# Altium schematic sheet AMC_SATA_Adapter.SchDoc: AMC to SATA
size 420 x 297 mm; Author: G.K.; CompanyName: WUT; DrawnBy: G.K.; Organization: CERN; Address1: Warsaw Univeristy of Technology; Address2: Nowowiejska 15/19; Revision: -; SheetNumber: -; SheetTotal: -; EDA_Number: ARTIQ; Projet: SINARA; ModifiedBy: -; CreateDate: XX/XX/XXXX; CheckedDate: -; Title2: Adapter; DivGrp: ISE; Designer: G.K.; ModifiedDate: -; ProjectName: SINARA
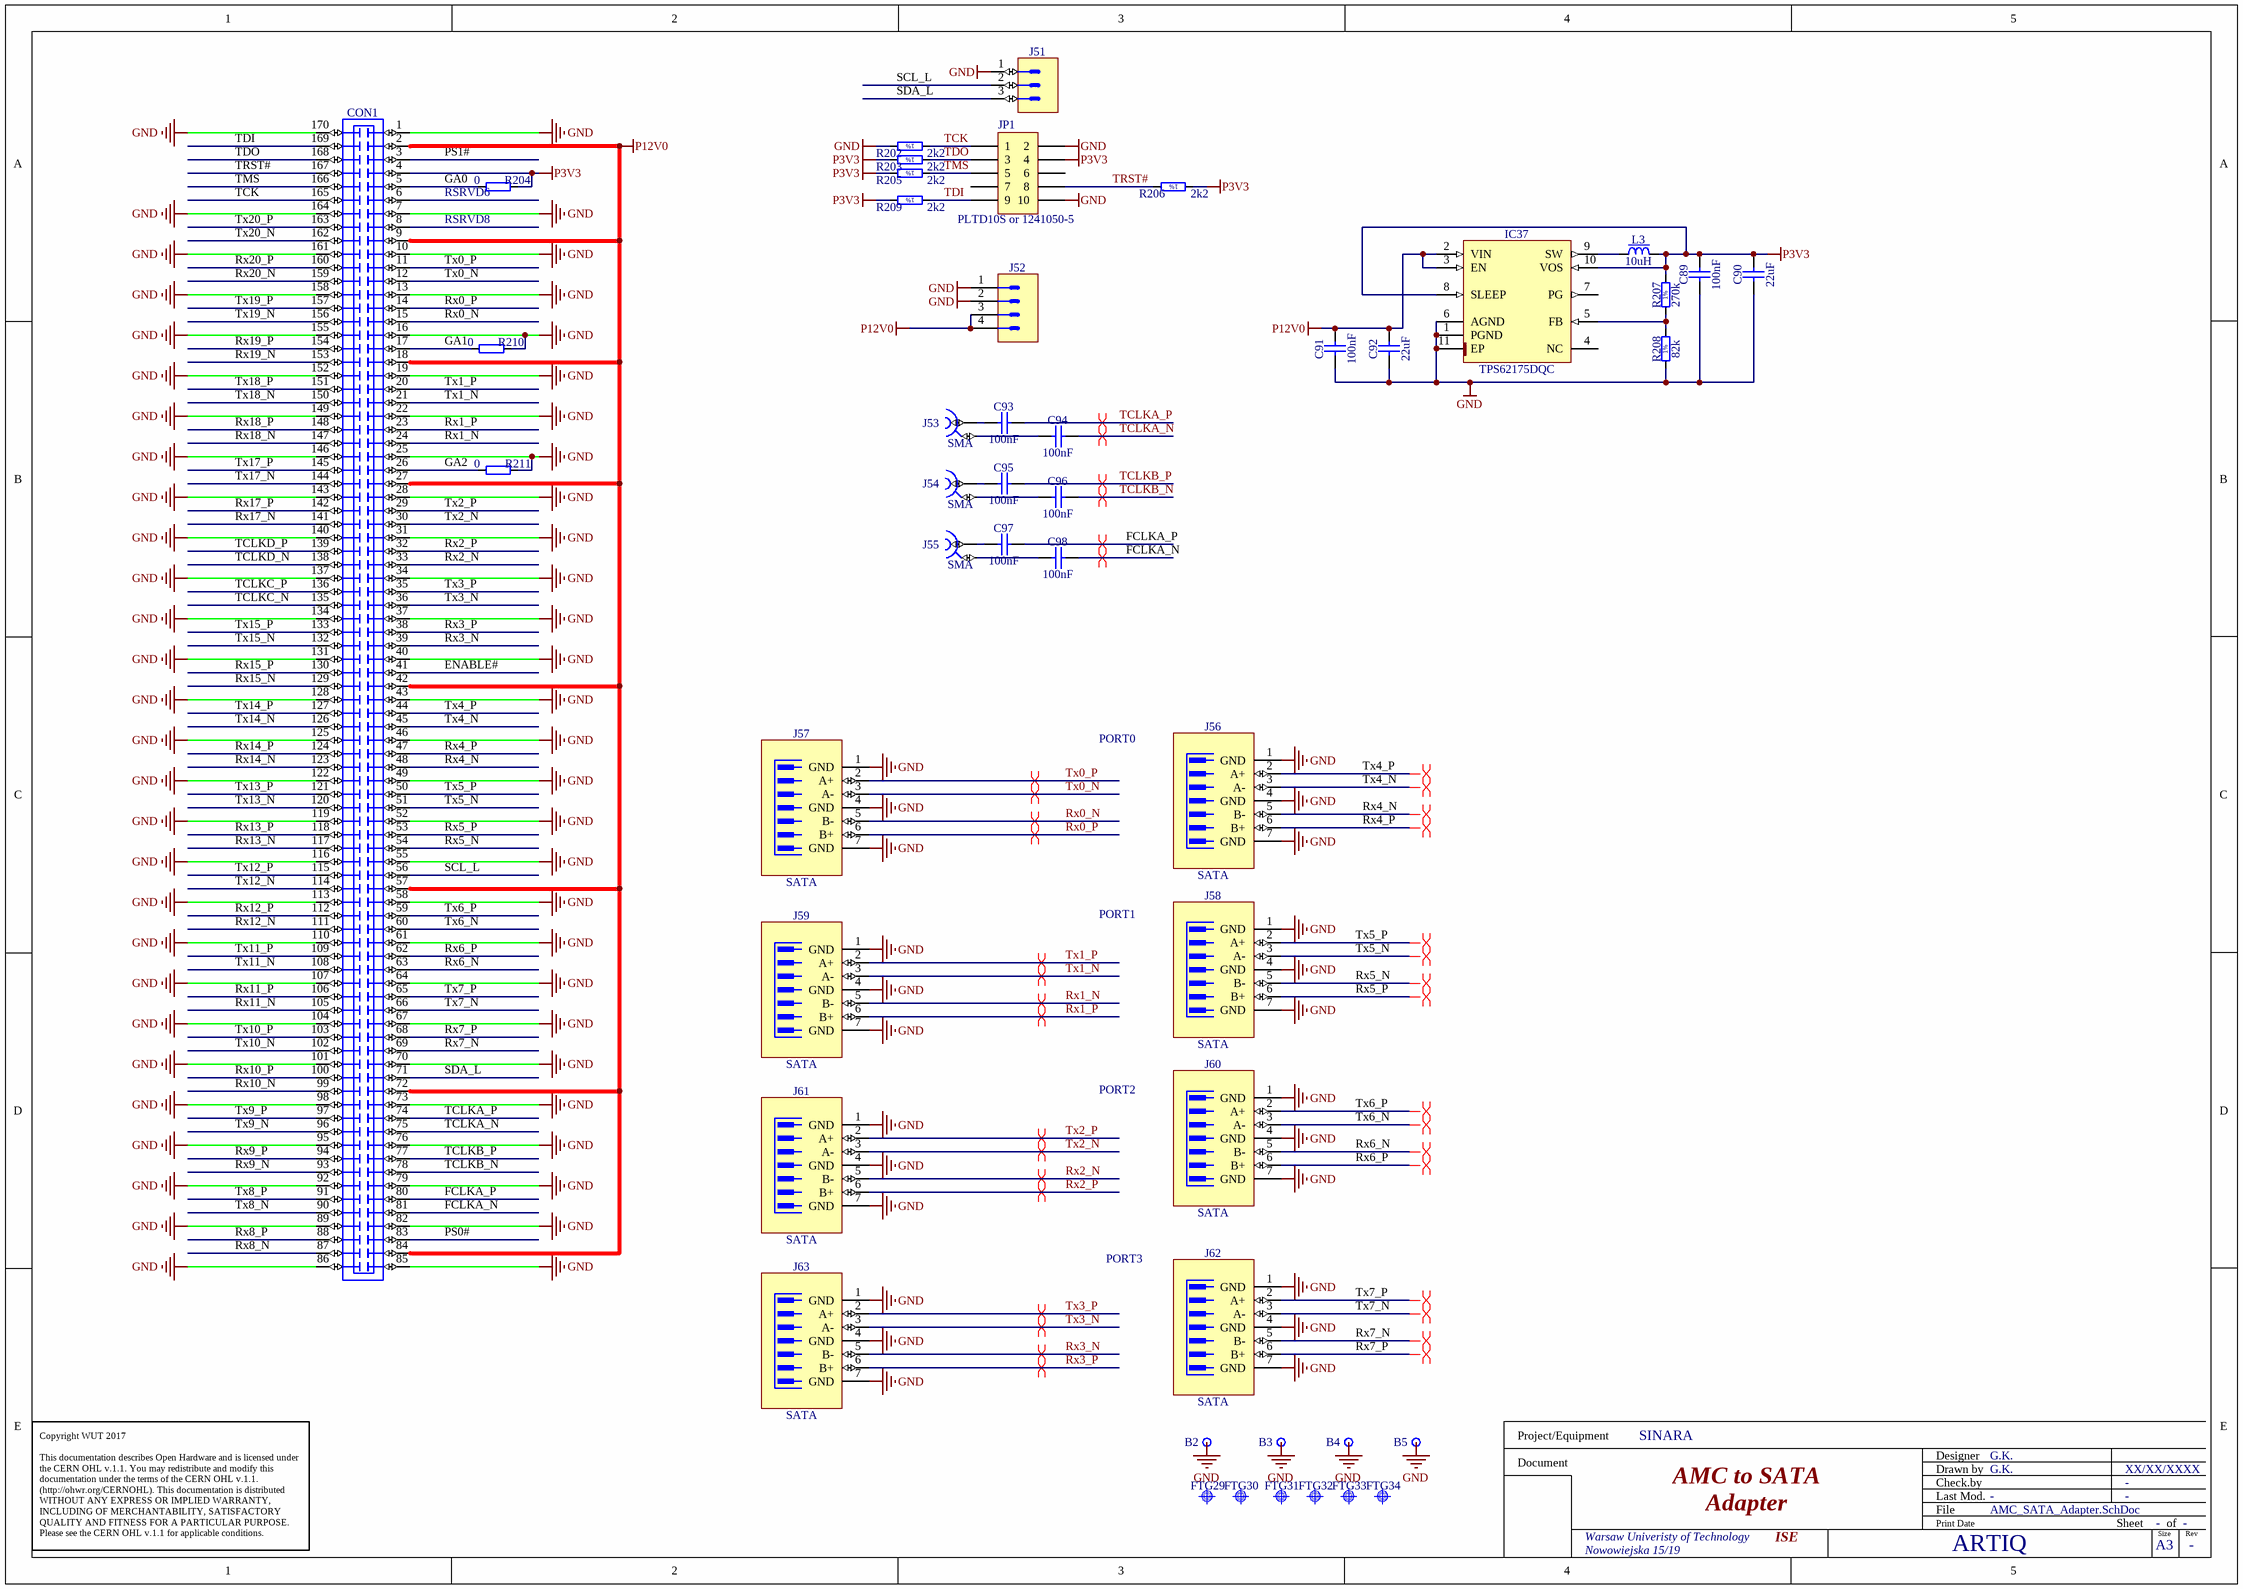
[diagram p0: AMC_SATA_Adapter.SchDoc]

## Parts
B2  (no value)  [MTG270_500]
B3  (no value)  [MTG270_500]
B4  (no value)  [MTG270_500]
B5  (no value)  [MTG270_500]
C89  100nF  [CAPC1005X55N]
C90  22uF  [CAPC2012X135N]
C91  100nF  [CAPC1005X55N]
C92  22uF  [CAPC2012X135N]
C93  100nF  [CAPC0603X33N]
C94  100nF  [CAPC0603X33N]
C95  100nF  [CAPC0603X33N]
C96  100nF  [CAPC0603X33N]
C97  100nF  [CAPC0603X33N]
C98  100nF  [CAPC0603X33N]
CON1  SAMTEC_MTCA-085-02-S-DV-SMT-K-TR  [SAMTEC_MTCA-085-02-S-DV-SMT-K-TR]  (value not drawn)
FTG29  Use only in PCB  (value not drawn)
FTG30  Use only in PCB  (value not drawn)
FTG31  Use only in PCB  (value not drawn)
FTG32  Use only in PCB  (value not drawn)
FTG33  Use only in PCB  (value not drawn)
FTG34  Use only in PCB  (value not drawn)
IC37  TPS62175DQC  [SON50P200X300X80-11N-R94X250]
J51  Header 3  [HARWIN_M22-2010305]  (value not drawn)
J52  Mini-Fit Jr.™  [MOLEX_39-28-1043]  (value not drawn)
J53  SMA  [HUBER-SUHNER_82_SMA-50-0-41/133_NE]
J54  SMA  [HUBER-SUHNER_82_SMA-50-0-41/133_NE]
J55  SMA  [HUBER-SUHNER_82_SMA-50-0-41/133_NE]
J56  SATA  [MOLEX_67800-5005]
J57  SATA  [MOLEX_67800-5005]
J58  SATA  [MOLEX_67800-5005]
J59  SATA  [MOLEX_67800-5005]
J60  SATA  [MOLEX_67800-5005]
J61  SATA  [MOLEX_67800-5005]
J62  SATA  [MOLEX_67800-5005]
J63  SATA  [MOLEX_67800-5005]
JP1  PLTD10S or 1241050-5  [PLTD10S]
L3  10uH  [IND_MURATA-PS_8400]
R202  2k2  [RESC1005X40N]
R203  2k2  [RESC1005X40N]
R204  0  [RESC1005X40N]
R205  2k2  [RESC1005X40N]
R206  2k2  [RESC1005X40N]
R207  270k  [RESC1608X55N]
R208  82k  [RESC1608X55N]
R209  2k2  [RESC1005X40N]
R210  0  [RESC1005X40N]
R211  0  [RESC1005X40N]

## Nets
GND: B2.1 B3.1 B4.1 B5.1 C89.1 C90.1 C91.1 C92.1 CON1.1 CON1.7 CON1.10 CON1.13 CON1.16 CON1.19 CON1.22 CON1.25 CON1.28 CON1.31 CON1.34 CON1.37 CON1.40 CON1.43 CON1.46 CON1.49 CON1.52 CON1.55 CON1.58 CON1.61 CON1.64 CON1.67 CON1.70 CON1.73 CON1.76 CON1.79 CON1.82 CON1.85 CON1.86 CON1.89 CON1.92 CON1.95 CON1.98 CON1.101 CON1.104 CON1.107 CON1.110 CON1.113 CON1.116 CON1.119 CON1.122 CON1.125 CON1.128 CON1.131 CON1.134 CON1.137 CON1.140 CON1.143 CON1.146 CON1.149 CON1.152 CON1.155 CON1.158 CON1.161 CON1.164 CON1.170 IC37.1(PGND) IC37.6(AGND) IC37.11(EP) J51.1 J52.1 J52.2 J56.1(GND) J56.4(GND) J56.7(GND) J57.1(GND) J57.4(GND) J57.7(GND) J58.1(GND) J58.4(GND) J58.7(GND) J59.1(GND) J59.4(GND) J59.7(GND) J60.1(GND) J60.4(GND) J60.7(GND) J61.1(GND) J61.4(GND) J61.7(GND) J62.1(GND) J62.4(GND) J62.7(GND) J63.1(GND) J63.4(GND) J63.7(GND) JP1.2 JP1.10 R202.2 R208.1 R210.2 R211.2
P3V3: C89.2 C90.2 CON1.4 IC37.8(SLEEP) IC37.10(VOS) JP1.4 L3.2 R203.2 R204.2 R205.2 R206.1 R207.2 R209.2
P12V0: C91.2 C92.2 CON1.2 CON1.9 CON1.18 CON1.27 CON1.42 CON1.57 CON1.72 CON1.84 IC37.2(VIN) IC37.3(EN) J52.3 J52.4
ENABLE#: CON1.41
FCLKA_N: C98.2 CON1.81
FCLKA_P: C97.2 CON1.80
GA0: CON1.5 R204.1
GA1: CON1.17 R210.1
GA2: CON1.26 R211.1
PS0#: CON1.83
PS1#: CON1.3
Rx0_N: CON1.15 J57.5(B-)
Rx0_P: CON1.14 J57.6(B+)
Rx1_N: CON1.24 J59.5(B-)
Rx1_P: CON1.23 J59.6(B+)
Rx2_N: CON1.33 J61.5(B-)
Rx2_P: CON1.32 J61.6(B+)
Rx3_N: CON1.39 J63.5(B-)
Rx3_P: CON1.38 J63.6(B+)
Rx4_N: CON1.48 J56.5(B-)
Rx4_P: CON1.47 J56.6(B+)
Rx5_N: CON1.54 J58.5(B-)
Rx5_P: CON1.53 J58.6(B+)
Rx6_N: CON1.63 J60.5(B-)
Rx6_P: CON1.62 J60.6(B+)
Rx7_N: CON1.69 J62.5(B-)
Rx7_P: CON1.68 J62.6(B+)
Rx8_N: CON1.87
Rx8_P: CON1.88
Rx9_N: CON1.93
Rx9_P: CON1.94
Rx10_N: CON1.99
Rx10_P: CON1.100
Rx11_N: CON1.105
Rx11_P: CON1.106
Rx12_N: CON1.111
Rx12_P: CON1.112
Rx13_N: CON1.117
Rx13_P: CON1.118
Rx14_N: CON1.123
Rx14_P: CON1.124
Rx15_N: CON1.129
Rx15_P: CON1.130
Rx17_N: CON1.141
Rx17_P: CON1.142
Rx18_N: CON1.147
Rx18_P: CON1.148
Rx19_N: CON1.153
Rx19_P: CON1.154
Rx20_N: CON1.159
Rx20_P: CON1.160
SCL_L: CON1.56 J51.2
SDA_L: CON1.71 J51.3
TCK: CON1.165 JP1.1 R202.1
TCLKA_N: C94.2 CON1.75
TCLKA_P: C93.2 CON1.74
TCLKB_N: C96.2 CON1.78
TCLKB_P: C95.2 CON1.77
TCLKC_N: CON1.135
TCLKC_P: CON1.136
TCLKD_N: CON1.138
TCLKD_P: CON1.139
TDI: CON1.169 JP1.9 R209.1
TDO: CON1.168 JP1.3 R203.1
TMS: CON1.166 JP1.5 R205.1
TRST#: CON1.167 JP1.8 R206.2
Tx0_N: CON1.12 J57.3(A-)
Tx0_P: CON1.11 J57.2(A+)
Tx1_N: CON1.21 J59.3(A-)
Tx1_P: CON1.20 J59.2(A+)
Tx2_N: CON1.30 J61.3(A-)
Tx2_P: CON1.29 J61.2(A+)
Tx3_N: CON1.36 J63.3(A-)
Tx3_P: CON1.35 J63.2(A+)
Tx4_N: CON1.45 J56.3(A-)
Tx4_P: CON1.44 J56.2(A+)
Tx5_N: CON1.51 J58.3(A-)
Tx5_P: CON1.50 J58.2(A+)
Tx6_N: CON1.60 J60.3(A-)
Tx6_P: CON1.59 J60.2(A+)
Tx7_N: CON1.66 J62.3(A-)
Tx7_P: CON1.65 J62.2(A+)
Tx8_N: CON1.90
Tx8_P: CON1.91
Tx9_N: CON1.96
Tx9_P: CON1.97
Tx10_N: CON1.102
Tx10_P: CON1.103
Tx11_N: CON1.108
Tx11_P: CON1.109
Tx12_N: CON1.114
Tx12_P: CON1.115
Tx13_N: CON1.120
Tx13_P: CON1.121
Tx14_N: CON1.126
Tx14_P: CON1.127
Tx15_N: CON1.132
Tx15_P: CON1.133
Tx17_N: CON1.144
Tx17_P: CON1.145
Tx18_N: CON1.150
Tx18_P: CON1.151
Tx19_N: CON1.156
Tx19_P: CON1.157
Tx20_N: CON1.162
Tx20_P: CON1.163
NetC93_1: C93.1 J53.1
NetC94_1: C94.1 J53.2
NetC95_1: C95.1 J54.1
NetC96_1: C96.1 J54.2
NetC97_1: C97.1 J55.1
NetC98_1: C98.1 J55.2
NetIC37_5: IC37.5(FB) R207.1 R208.2
NetIC37_9: IC37.9(SW) L3.1

Not connected (* = marked no-connect by the designer): CON1 6 8; IC37 4(NC) 7(PG); JP1 6 7

## Layout directives
differential pair: FCLKA_N, FCLKA_P, Rx0_N, Rx0_P, Rx1_N, Rx1_P, Rx2_N, Rx2_P, Rx3_N, Rx3_P, Rx4_N, Rx4_P, Rx5_N, Rx5_P, Rx6_N, Rx6_P, Rx7_N, Rx7_P, TCLKA_N, TCLKA_P, TCLKB_N, TCLKB_P, Tx0_N, Tx0_P, Tx1_N, Tx1_P, Tx2_N, Tx2_P, Tx3_N, Tx3_P, Tx4_N, Tx4_P, Tx5_N, Tx5_P, Tx6_N, Tx6_P, Tx7_N, Tx7_P

## Notes on the sheet
- (near R204) RSRVD6
- (near R204) RSRVD8
- PORT0
- PORT1
- PORT2
- PORT3
- Copyright WUT 2017
  This documentation describes Open Hardware and is licensed under the CERN OHL v.1.1. You may redistribute and modify this documentation under the terms of the CERN OHL v.1.1. (http://ohwr.org/CERNOHL). This documentation is distributed WITHOUT ANY EXPRESS OR IMPLIED WARRANTY, INCLUDING OF MERCHANTABILITY, SATISFACTORY QUALITY AND FITNESS FOR A PARTICULAR PURPOSE. Please see the CERN OHL v.1.1 for applicable conditions.
- Project/Equipment
- Document
- Designer
- Drawn by
- Check.by
- File
- Last Mod.
- Print Date
- Sheet
- Size
- A3
- of
- Rev
- (in symbol R0402_2K2_1%_0.0625W_100PPM) 1%
- (in symbol R0603_82K_1%_0.1W_100PPM) 1%
- (in symbol R0603_270K_1%_0.1W_100PPM) 1%

## Library data of the parts
B2-B5 = Through Hole Pad
C89 C91 = CC0402_100NF_16V_10%_X5R: Non-polarised capacitor; Part Description: SMD Multilayer Chip Ceramic Capacitor; Manufacturer: GENERIC; Manufacturer1 Part Number: GRM155R61C104KA88D; Voltage: 16V; TC: X5R; Tolerance: ±10%; Part Number: CC0402_100NF_16V_10%_X5R; Component Kind: Standard; Component Type: Standard; Pin Count: 2; Value: 100nF; Status: None; Manufacturer Part Number: CC0402_100NF_16V_10%_X5R; Case: 0402; Mounted: Yes; Socket: No; SMD: Yes; Sense: No; Manufacturer1 Example: MURATA; Manufacturer1 ComponentHeight: 0.55mm; HelpURL: \\cern.ch\dfs\Applications\Altium\Datasheets\CC0402_X5R_MURATA_GRM.pdf; Author: CERN DEM JLC; CreateDate: 10.12.2013; LatestRevisionDate: 10.12.2013
C90 C92 = CC0805_22UF_16V_10%_X5R: Non-polarised capacitor; Part Description: SMD Multilayer Chip Ceramic Capacitor; Manufacturer: GENERIC; Manufacturer1 Part Number: C2012X5R1C226KT; Voltage: 16V; TC: X5R; Tolerance: ±10%; Part Number: CC0805_22UF_16V_10%_X5R; Component Kind: Standard; Component Type: Standard; Pin Count: 2; Value: 22uF; Status: Preferred; Manufacturer Part Number: CC0805_22UF_16V_10%_X5R; Case: 0805; Mounted: Yes; Socket: No; SMD: Yes; Sense: No; Manufacturer1 Example: TDK; Manufacturer1 ComponentHeight: 1.35mm; HelpURL: \\cern.ch\dfs\Applications\Altium\Datasheets\CC0805_X5R_TDK_C.pdf; Author: CERN DEM JLC; CreateDate: 25.10.2012; LatestRevisionDate: 25.10.2012
C93-C98 = CC0201_100NF_6.3V_10%_X5R: Non-polarised capacitor; Part Description: SMD Multilayer Chip Ceramic Capacitor; Manufacturer: GENERIC; Manufacturer1 Part Number: 02016D104KAT2A; Voltage: 6.3V; TC: X5R; Tolerance: ±10%; Part Number: CC0201_100NF_6.3V_10%_X5R; Component Kind: Standard; Component Type: Standard; Pin Count: 2; Value: 100nF; Status: Not Recommended; Manufacturer Part Number: CC0201_100NF_6.3V_10%_X5R; Case: 0201; Mounted: Yes; Socket: No; SMD: Yes; Sense: No; Manufacturer1 Example: AVX; Manufacturer1 ComponentHeight: 0.33mm; HelpURL: \\cern.ch\dfs\Applications\Altium\Datasheets\CC0201_X5R_AVX.pdf; Author: CERN DEM JLC; CreateDate: 03.12.2007; LatestRevisionDate: 03.12.2007
CON1 = SAMTEC_MTCA-085-02-S-DV-SMT-K-TR: 170 Poles,  Micro TCA (Telecom Computing Architecture) Edge Card Socket; Part Description: 170 Poles, Pitch 0.75mm, Micro TCA (Telecom Computing Architecture) Edge Card Socket; Manufacturer: SAMTEC; Part Number: SAMTEC_MTCA-085-02-S-DV-SMT-K-TR; Component Kind: Standard; Component Type: Standard; Pin Count: 170; Mounted: Yes; Socket: No; SMD: Yes; Status: None; Manufacturer Part Number: MTCA-085-02-S-DV-SMT-K-TR; ComponentHeight: 12.85mm; HelpURL: \\cern.ch\dfs\Applications\Altium\Datasheets\SAMTEC_MTCA-085-02-S-DV-SMT-K-TR.pdf; Author: CERN DEM JLC; CreateDate: 2012-08-15; LatestRevisionDate: 2012-08-15; Table: SAMTEC
FTG29-FTG34 = Fiducial Target
IC37 = TPS62175DQC: 4.75-28VDC to 1-6VDC, 500mA Step-Down Converter With Sleep Mode; Manufacturer: TEXAS INSTRUMENTS; PressFit: No; Bonding: No; Part Number: TPS62175DQC; Component Kind: Standard; Component Type: Standard; Device: TPS62175DQC; PackageDescription: SON, 10-Leads, Body 2x3mm, Pitch 0.5mm, Thermal Pad 0.94x2.5mm, IPC Medium Density; Part Description: 4.75-28VDC to 1-6VDC, 500mA Step-Down Converter With Sleep Mode; Manufacturer Part Number: TPS62175DQC; Pin Count: 11; Case: SON10; Mounted: Yes; Socket: No; SMD: Yes; Sense: No; ComponentHeight: 0.8mm; HelpURL: \\cern.ch\dfs\Applications\Altium\Datasheets\TPS62175DQC.pdf; Author: CERN DEM JMW; CreateDate: 11.08.2015; LatestRevisionDate: 11.08.2015
J51 = HARWIN_M22-2010305: Connector 3 Male; Part Description: 3 Contacts - Pitch 2mm - Single Row Through Mount Straight Header (Post Lead = 3.5mm, Tail Lead 3.4mm, Insulator 1.5mm); Manufacturer: HARWIN; PressFit: No; Part Number: HARWIN_M22-2010305; Component Kind: Standard; Component Type: Standard; Pin Count: 3; Family: Header 3; Mounted: Yes; Socket: No; SMD: No; Sense: No; Status: None; Manufacturer Part Number: M22-2010305; ComponentHeight: 5mm; HelpURL: \\cern.ch\dfs\Applications\Altium\Datasheets\HARWIN_M22-2010305.pdf; Author: CERN DEM JLC; CreateDate: 14.04.2015; LatestRevisionDate: 14.04.2015
J52 = MOLEX_39-28-1043: Connector 4 Male; Part Description: 4.20mm (.165") Pitch Mini-Fit Jr.™ Header, Dual Row, Vertical, without Snap-in Plastic Peg PCB Lock, 4 Circuits; Manufacturer: MOLEX; Part Number: MOLEX_39-28-1043; Component Kind: Standard; Component Type: Standard; Pin Count: 4; Family: Mini-Fit Jr.™; Mounted: Yes; Socket: No; SMD: No; Status: None; Manufacturer Part Number: 39-28-1043; ComponentHeight: 13.1mm; HelpURL: \\cern.ch\dfs\Applications\Altium\Datasheets\MOLEX_39-28-1043.pdf; Author: CERN DEM JLC; CreateDate: 2009-03-12; LatestRevisionDate: 2012-03-06; Table: MOLEX
J53-J55 = HUBER-SUHNER_82_SMA-50-0-41/133_NE: Part Description: SMA 50 Ohms Straight PCB Jack; Manufacturer: HUBER+SUHNER; PressFit: No; Part Number: HUBER-SUHNER_82_SMA-50-0-41/133_NE; Component Kind: Standard; Component Type: Standard; Pin Count: 2; Family: SMA; Mounted: Yes; Socket: No; SMD: No; Sense: No; Status: None; Manufacturer Part Number: 82_SMA-50-0-41/133_NE; ComponentHeight: 9.6mm; HelpURL: \\cern.ch\dfs\Applications\Altium\Datasheets\HUBER-SUHNER_82_SMA-50-0-41-133_NE.pdf; Author: CERN DEM JLC; CreateDate: 20.04.2010; LatestRevisionDate: 06.11.2014
J56-J63 = MOLEX_67800-5005: 7 Pin SATA Receptacle; Part Description: 1.27mm Pitch, 7 Contacts, Serial ATA High Speed Header, Straight with Locking Latch; Manufacturer: MOLEX; PressFit: No; Part Number: MOLEX_67800-5005; Component Kind: Standard; Component Type: Standard; Pin Count: 7; Family: SATA; Mounted: Yes; Socket: No; SMD: Yes; Sense: No; Status: None; Manufacturer Part Number: 67800-5005; ComponentHeight: 8.4mm; HelpURL: \\cern.ch\dfs\Applications\Altium\Datasheets\MOLEX_67800-5005.pdf; Author: CERN DEM MR; CreateDate: 01.12.2016; LatestRevisionDate: 01.12.2016
JP1 = CON_2x5 2.54 male SMT: Goldpin 2.54mm, male header
L3 = IND_10UH_10%_MURATA-PS_8400: Inductor With Core; Part Description: Miniature Surface Mount Power Inductor (8400 Serie); Manufacturer: MURATA POWER SOLUTIONS; Manufacturer Part Number: 84103C; Power: 950mA; Resistance: 0.24R; Tolerance: ±10%; Part Number: IND_10UH_10%_MURATA-PS_8400; Component Kind: Standard; Component Type: Standard; Pin Count: 2; Value: 10uH; Status: None; Mounted: Yes; Socket: No; SMD: Yes; Sense: No; ComponentHeight: 2.9mm; HelpURL: \\cern.ch\dfs\Applications\Altium\Datasheets\IND_MURATA-PS_8400.pdf; Author: CERN DEM JLC; CreateDate: 02.07.2012; LatestRevisionDate: 02.07.2012
R202 R203 R205 R206 R209 = R0402_2K2_1%_0.0625W_100PPM: Resistor - 1%; Part Description: General Purpose Thick Film Chip Resistor; Manufacturer: GENERIC; Manufacturer1 Part Number: 232270672202L; TC: ±100ppm/°C; Part Number: R0402_2K2_1%_0.0625W_100PPM; Component Kind: Standard; Component Type: Standard; Pin Count: 2; Value: 2k2; Status: Not recommended; Power: 0.0625W; Tolerance: ±1%; Manufacturer Part Number: R0402_2K2_1%_0.0625W_100PPM; Case: 0402; Mounted: Yes; Sense: No; Socket: No; SMD: Yes; Manufacturer1 Example: YAGEO PHYCOMP; Manufacturer1 ComponentHeight: 0.4mm; HelpURL: \\cern.ch\dfs\Applications\Altium\Datasheets\R0402_Phycomp_RC0402.pdf; Author: CERN DEM JLC; CreateDate: 03.12.2007; LatestRevisionDate: 17.10.2012
R204 R210 R211 = R0402_0R_JUMPER: Resistor; Part Description: 1A (0.05R Max DC Resistance) Zero Ohm Jumper; Manufacturer: GENERIC; Manufacturer1 Part Number: 232270591001L; Part Number: R0402_0R_JUMPER; Component Kind: Standard; Component Type: Standard; Pin Count: 2; Value: 0; Status: Not recommended; Manufacturer Part Number: R0402_0R_JUMPER; Case: 0402; Mounted: Yes; Sense: No; Socket: No; SMD: Yes; Manufacturer1 Example: YAGEO PHYCOMP; Manufacturer1 ComponentHeight: 0.4mm; HelpURL: \\cern.ch\dfs\Applications\Altium\Datasheets\R0402_Phycomp_RC0402.pdf; Author: CERN DEM JLC; CreateDate: 03.12.2007; LatestRevisionDate: 17.10.2012
R207 = R0603_270K_1%_0.1W_100PPM: Resistor - 1%; Part Description: General Purpose Thick Film Chip Resistor; Manufacturer: GENERIC; Manufacturer1 Part Number: NRC06F2703TRF; Power: 0.1W; TC: ±100ppm/°C; Part Number: R0603_270K_1%_0.1W_100PPM; Component Kind: Standard; Component Type: Standard; Pin Count: 2; Value: 270k; Status: Preferred; Tolerance: ±1%; Manufacturer Part Number: R0603_270K_1%_0.1W_100PPM; Case: 0603; Mounted: Yes; Sense: No; Socket: No; SMD: Yes; Manufacturer1 Example: NIC COMPONENT; Manufacturer1 ComponentHeight: 0.55mm; HelpURL: \\cern.ch\dfs\Applications\Altium\Datasheets\R0603_NIC_NRC.pdf; Author: CERN DEM JLC; CreateDate: 03.12.2007; LatestRevisionDate: 13.03.2008
R208 = R0603_82K_1%_0.1W_100PPM: Resistor - 1%; Part Description: General Purpose Thick Film Chip Resistor; Manufacturer: GENERIC; Manufacturer1 Part Number: NRC06F8202TRF; Power: 0.1W; TC: ±100ppm/°C; Part Number: R0603_82K_1%_0.1W_100PPM; Component Kind: Standard; Component Type: Standard; Pin Count: 2; Value: 82k; Status: Preferred; Tolerance: ±1%; Manufacturer Part Number: R0603_82K_1%_0.1W_100PPM; Case: 0603; Mounted: Yes; Sense: No; Socket: No; SMD: Yes; Manufacturer1 Example: NIC COMPONENT; Manufacturer1 ComponentHeight: 0.55mm; HelpURL: \\cern.ch\dfs\Applications\Altium\Datasheets\R0603_NIC_NRC.pdf; Author: CERN DEM JLC; CreateDate: 03.12.2007; LatestRevisionDate: 13.03.2008